# EAGLE design PSOC_CY8C24123 (EAGLE 7.4.0)
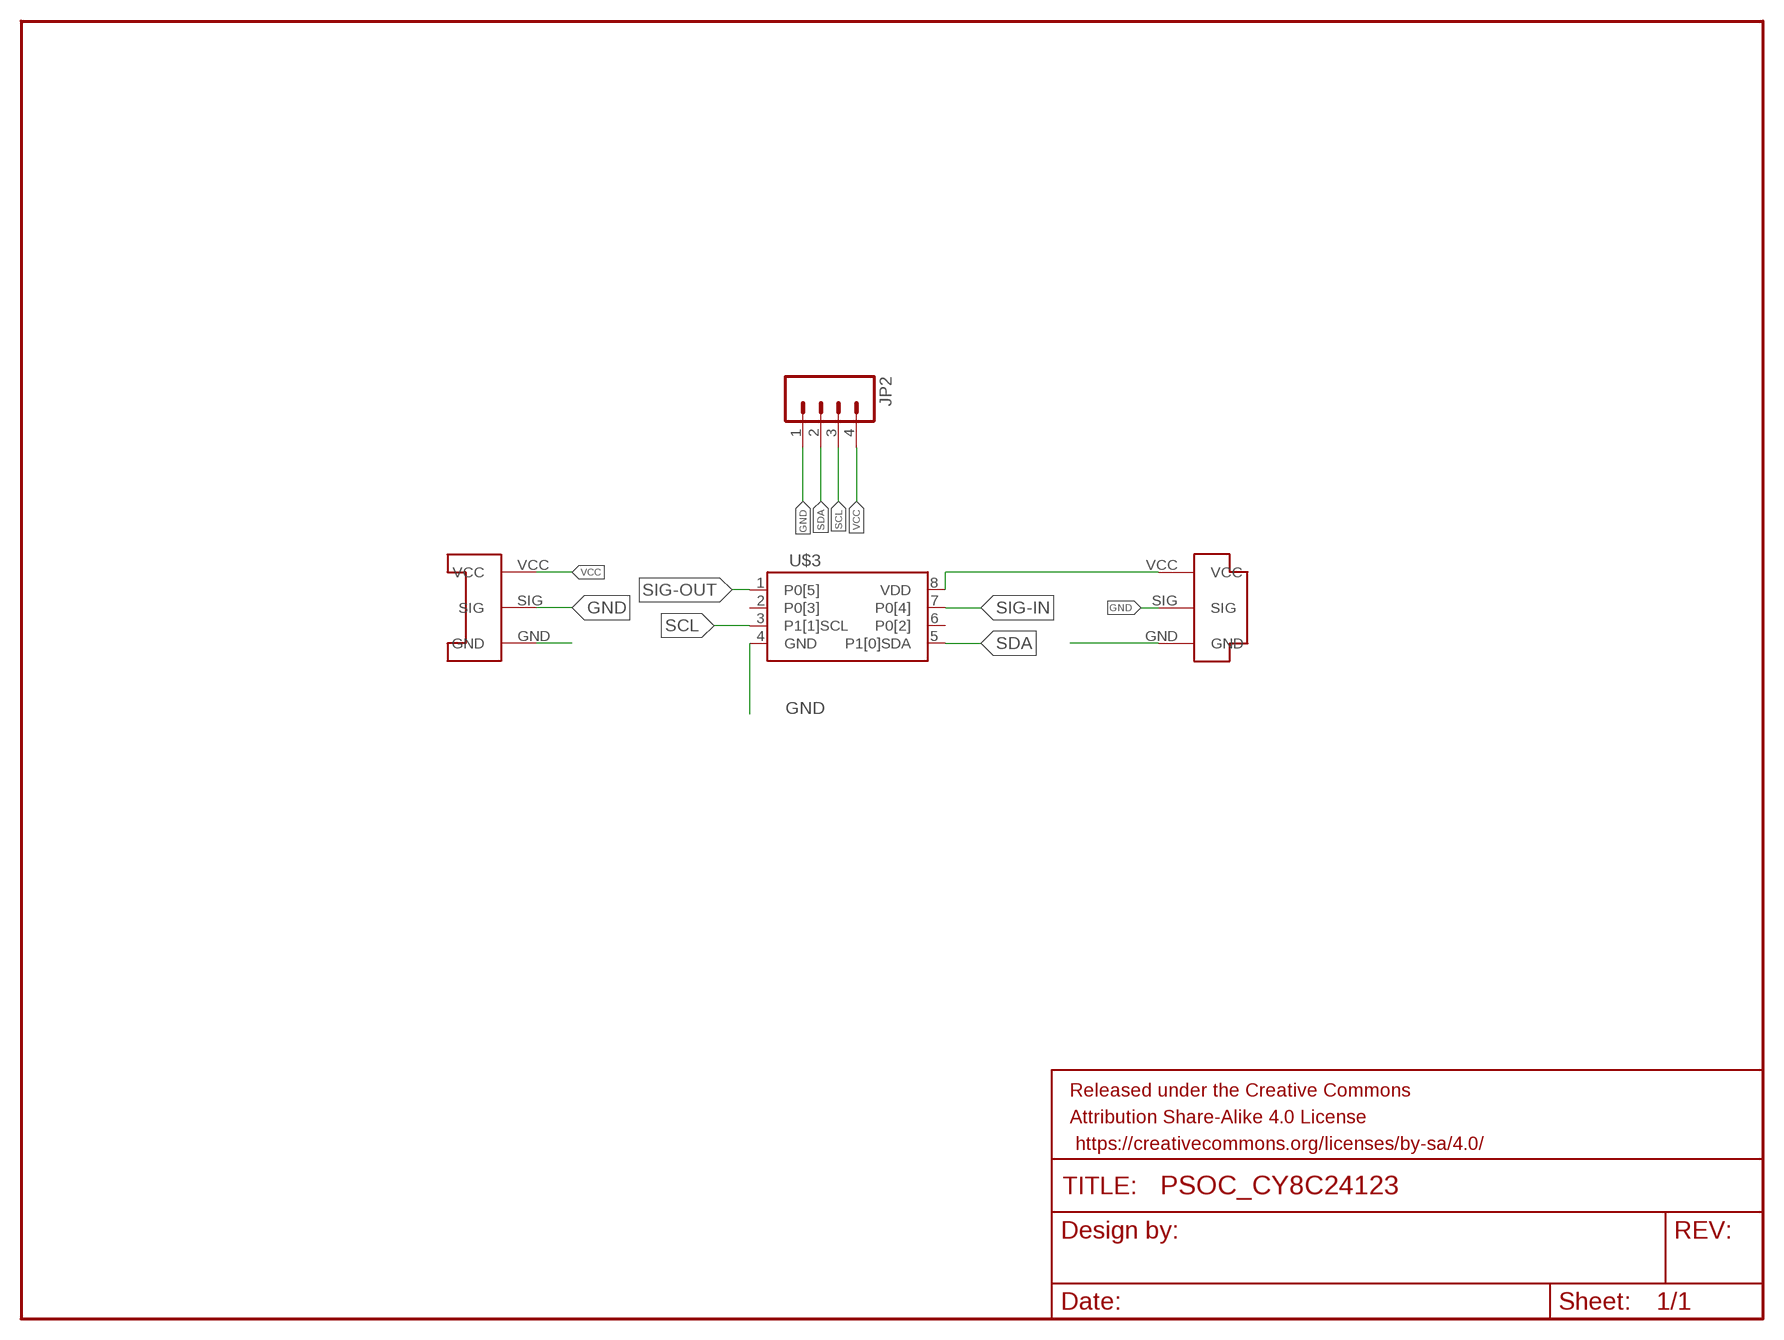
[diagram p0: schematic, sheet 1]

## Parts
FRAME1  FRAME-LETTERNO_PACKAGE  [DUMMY]
JP2  M041.27MM  [1X04-1.27MM]
U$1  CONN-PLUG-3POS-3MM  [PLUG-3POS-3MM-SMD]
U$2  CONN-SOCKET-3POS-3MM  [SOCKET-3POS-3MM-SMD]
U$3  CY8C24123A-24SXI  [SOIC8-PSOC1]

## Nets
GND: JP2.1(VDD) U$1.SIG U$2.SIG U$3.4(GND)
SCL: JP2.3(SIG-OUT) U$3.3(P1[1]SCL)
SDA: JP2.2(COM-OUT) U$3.5(P1[0]SDA)
SIG-IN: U$2.GND U$3.7(P0[4])
SIG-OUT: U$1.GND U$3.1(P0[5])
VCC: JP2.4(GND) U$1.VCC U$2.VCC U$3.8(VDD)
Unconnected: U$3.2(P0[3]) U$3.6(P0[2])

## Library data of the parts
FRAME1 = SparkFun-Aesthetics:FRAME-LETTER: Schematic Frame Standard 8.5x11 US Letter frame; DESIGNER: Nobody; VERSION: v01
JP2 = SparkFun-Connectors:M04: Header 4 Standard 4-pin 0.1" header. Use with straight break away headers (SKU : PRT-00116), right angle break away headers (PRT-00553), swiss pins (PRT-00743), machine pins (PRT-00117), and female headers (PRT-00115). Molex polarized connector foot print use with SKU : PRT-08231 with associated crimp pins and housings. 1MM SMD Version SKU: PRT-10208
U$1 = EmbeddedPlayground:CONN-PLUG-3POS-3MM: Surface mount board to board connector. Female socket, 3 position.
U$2 = EmbeddedPlayground:CONN-SOCKET-3POS-3MM: Surface mount board to board connector. Female socket, 3 position.
U$3 = SparkFun-DigitalIC:CY8C24123A-24SXI: CY8C2XXXX

## Board
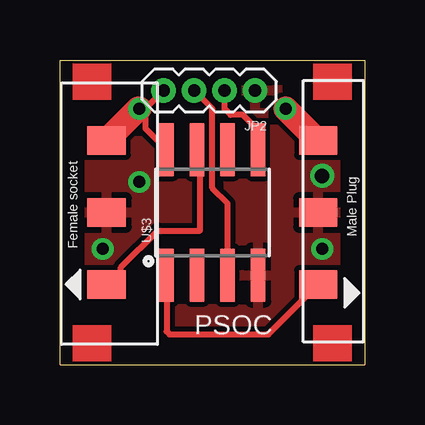
[diagram p1: board, top side]
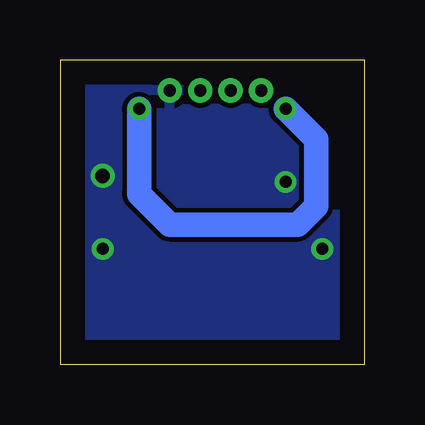
[diagram p2: board, bottom side, seen from below]

Size 12.7 x 12.7 mm. Coordinates in mm from the lower left corner, seen from the top.
Outline: 0,0 12.7,0 12.7,12.7 0,12.7 0,0
Copper layers (1*16): Top 0.035mm / dielectric 1.5mm / Bottom 0.035mm
Design rules "default": minimum track width 10mil, minimum drill 24mil, track to track 8mil, track to pad 8mil, pad to pad 8mil, via to via 8mil, smd to smd 8mil, copper to edge 40mil, drill to drill 8mil, minimum pad ring 10mil, minimum via ring 8mil, stop-mask expansion 4mil, vias tented up to drill 0mil, thermal gap 10mil

### Footprints (pad centres in the part's own frame; a part is rotated, then mirrored left to right if it is on the bottom)
1X04-1.27MM = drill 0.508 pad 1: 1 0,0; 2 1.27,0; 3 2.54,0; 4 3.81,0
PLUG-3POS-3MM-SMD = smd 1.2 x 1.6: GND 3,0; SIG 0,0; VCC -3,0
SOCKET-3POS-3MM-SMD = smd 1.2 x 1.6: GND -3,0; SIG 0,0; VCC 3,0
SOIC8-PSOC1 = smd 2.21 x 0.61: 1 -2.616,1.905; 2 -2.616,0.635; 3 -2.616,-0.635; 4 -2.616,-1.905; 5 2.616,-1.905; 6 2.616,-0.635; 7 2.616,0.635; 8 2.616,1.905

### Placement (x,y rotation side)
FRAME1  0,0 0 top
JP2  8.13,11.43 180 top
U$1  10.76,6.35 270 top
U$2  1.94,6.35 90 top
U$3  6.35,6.35 90 top

### Tracks (layer width: path | path; a pad name or v marks a point on that pad's centre or on a via)
GND  (via drill 0.5, 0.6)
  other vias: 3.3,7.62 10.92,7.87 1.78,4.83 10.92,4.83
  pour Top: -1.27,14.16 -1.27,-1.27 16.67,-1.27 16.67,14.16
  pour Bottom: -1.27,15.43 16.67,15.43 16.67,-1.27 -1.27,-1.27
SCL
  Top 0.254: U$3.3 6.99,6.73 6.35,7.37 6.35,10.67 JP2.3
SDA
  Top 0.254: U$3.5 8.26,9.78 7.62,10.41 7.11,10.41 6.86,10.67 JP2.2
SIG-IN
  Top 0.254: U$2.GND 2.54,3.81 2.54,4.06 4.06,5.59 5.84,5.59 5.84,8.84 U$3.7
SIG-OUT
  Top 0.254: U$3.1 4.45,1.4 4.57,1.27 8.68,1.27 U$1.GND
VCC  (via drill 0.5)
  Top 0.254: 4.32,9.09 U$3.8 3.56,9.86 3.56,10.67 | v3.3,10.67 3.56,10.67 | 3.56,10.67 JP2.4
  Top 1.016: U$1.VCC 10.72,9.35 v9.4,10.67 | v3.3,10.67 3.26,10.67 U$2.VCC
  Bottom 1.016: v9.4,10.67 9.4,7.11 8.13,5.84 2.79,5.84 2.03,6.6 2.03,9.4 v3.3,10.67

### Text on the board
tPlace: PSOC